# EAGLE design moduloComunicacao3 (EAGLE 9.5.2)
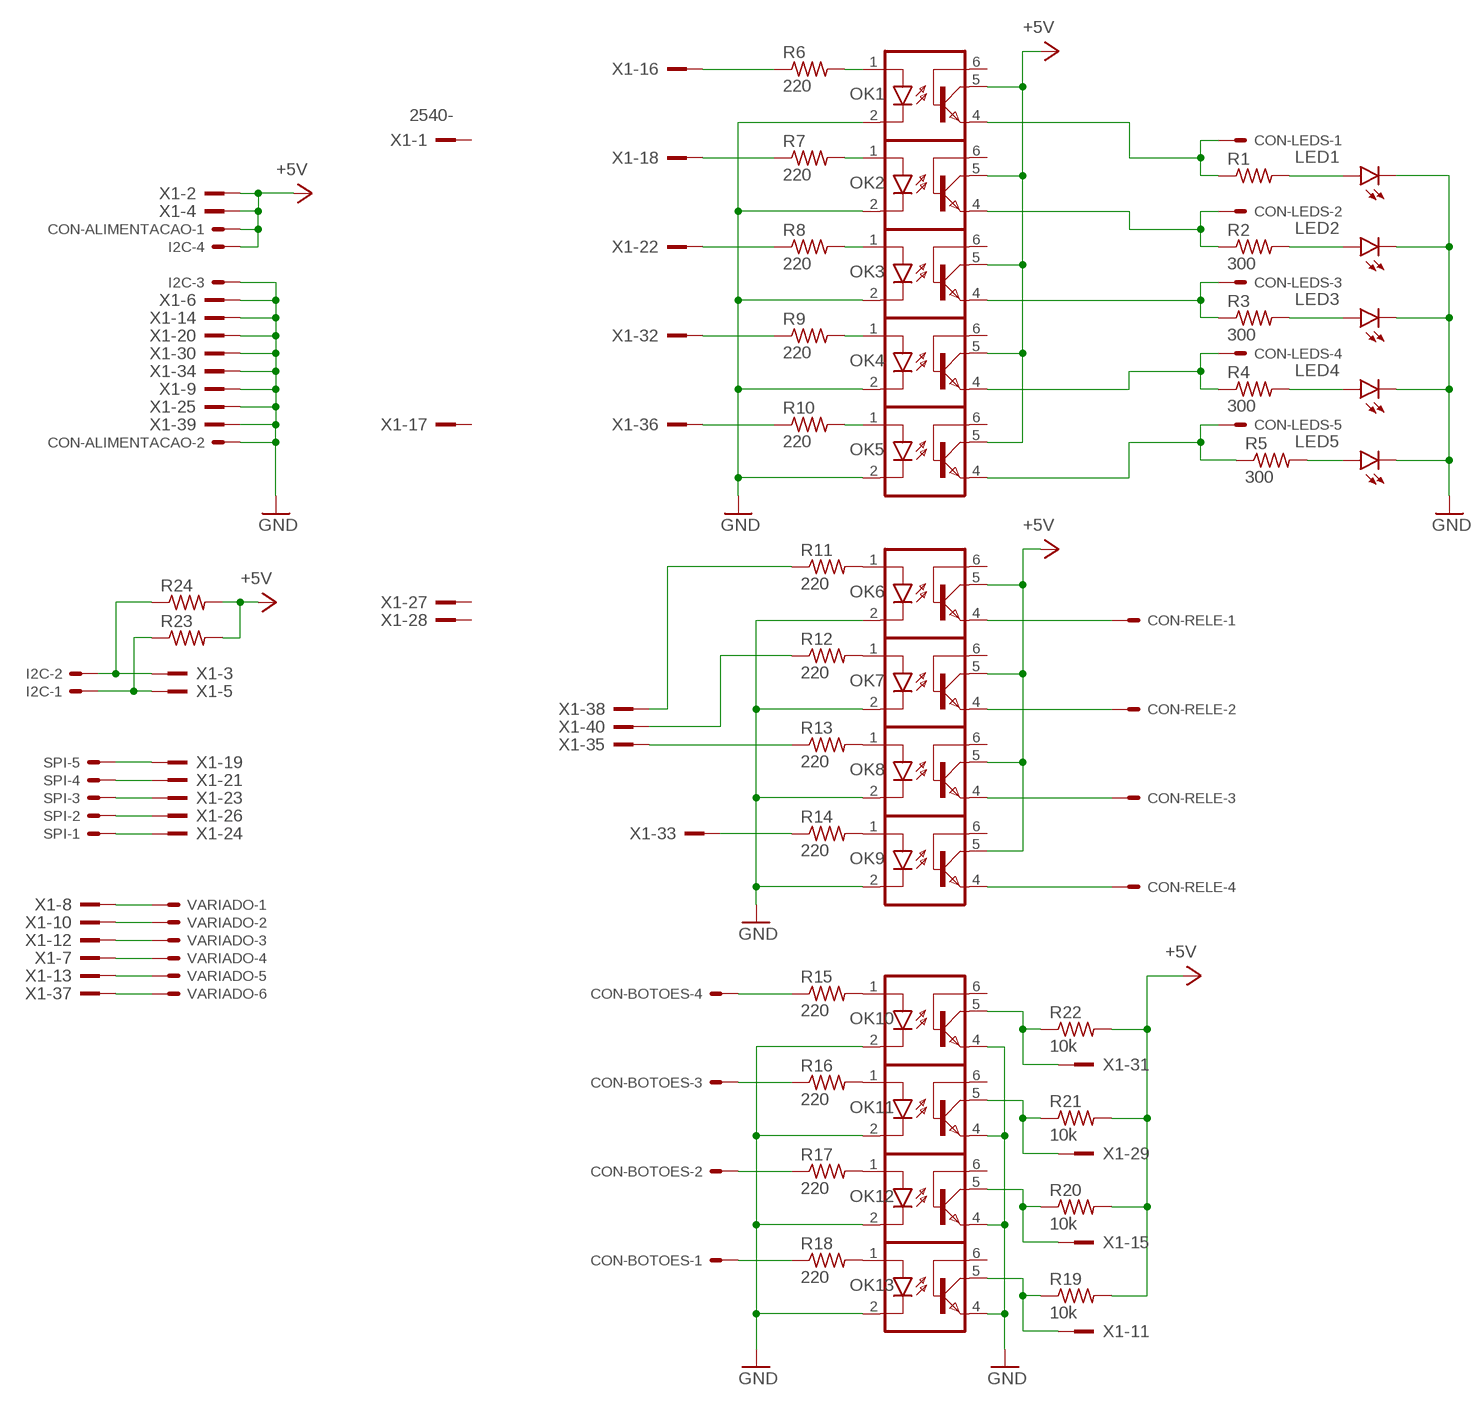
[diagram p0: schematic, sheet 1]

## Parts
CON-ALIMENTACAO  22-23-2021  [22-23-2021]
CON-BOTOES  22-23-2041  [22-23-2041]
CON-LEDS  22-23-2051  [22-23-2051]
CON-RELE  22-23-2041  [22-23-2041]
I2C  22-23-2041  [22-23-2041]
LED1  LED5MM  [LED5MM]
LED2  LED5MM  [LED5MM]
LED3  LED5MM  [LED5MM]
LED4  LED5MM  [LED5MM]
LED5  LED5MM  [LED5MM]
OK1  4N25M  [DIL06]
OK2  4N25M  [DIL06]
OK3  4N25M  [DIL06]
OK4  4N25M  [DIL06]
OK5  4N25M  [DIL06]
OK6  4N25M  [DIL06]
OK7  4N25M  [DIL06]
OK8  4N25M  [DIL06]
OK9  4N25M  [DIL06]
OK10  4N25M  [DIL06]
OK11  4N25M  [DIL06]
OK12  4N25M  [DIL06]
OK13  4N25M  [DIL06]
R1  R-US_0207/12  [0207/12]
R2  300  R-US_0207/12  [0207/12]
R3  300  R-US_0207/12  [0207/12]
R4  300  R-US_0207/12  [0207/12]
R5  300  R-US_0207/12  [0207/12]
R6  220  R-US_0204/7  [0204/7]
R7  220  R-US_0204/7  [0204/7]
R8  220  R-US_0204/7  [0204/7]
R9  220  R-US_0204/7  [0204/7]
R10  220  R-US_0204/7  [0204/7]
R11  220  R-US_0204/7  [0204/7]
R12  220  R-US_0204/7  [0204/7]
R13  220  R-US_0204/7  [0204/7]
R14  220  R-US_0204/7  [0204/7]
R15  220  R-US_0207/10  [0207/10]
R16  220  R-US_0207/10  [0207/10]
R17  220  R-US_0207/10  [0207/10]
R18  220  R-US_0207/10  [0207/10]
R19  10k  R-US_0204/7  [0204/7]
R20  10k  R-US_0204/7  [0204/7]
R21  10k  R-US_0204/7  [0204/7]
R22  10k  R-US_0204/7  [0204/7]
R23  R-US_0204/5  [0204/5]
R24  R-US_0204/5  [0204/5]
SPI  22-23-2051  [22-23-2051]
VARIADO  22-23-2061  [22-23-2061]
X1  2540-  [PAK100/2500-40]

## Nets
+5V: CON-ALIMENTACAO.1 I2C.4 OK1.5(COL) OK2.5(COL) OK3.5(COL) OK4.5(COL) OK5.5(COL) OK6.5(COL) OK7.5(COL) OK8.5(COL) OK9.5(COL) R19.2 R20.2 R21.2 R22.2 R23.2 R24.2 X1.2 X1.4
GND: CON-ALIMENTACAO.2 I2C.3 LED1.K(C) LED2.K(C) LED3.K(C) LED4.K(C) LED5.K(C) OK1.2(C) OK2.2(C) OK3.2(C) OK4.2(C) OK5.2(C) OK6.2(C) OK7.2(C) OK8.2(C) OK9.2(C) OK10.2(C) OK10.4(EMI) OK11.2(C) OK11.4(EMI) OK12.2(C) OK12.4(EMI) OK13.2(C) OK13.4(EMI) X1.6 X1.9 X1.14 X1.20 X1.25 X1.30 X1.34 X1.39
N$1: LED1.A R1.2
N$2: LED2.A R2.2
N$3: LED3.A R3.2
N$4: LED4.A R4.2
N$5: LED5.A R5.2
N$6: CON-LEDS.1 OK1.4(EMI) R1.1
N$7: CON-LEDS.2 OK2.4(EMI) R2.1
N$8: CON-LEDS.3 OK3.4(EMI) R3.1
N$9: CON-LEDS.4 OK4.4(EMI) R4.1
N$10: CON-LEDS.5 OK5.4(EMI) R5.1
N$11: CON-RELE.1 OK6.4(EMI)
N$12: CON-RELE.2 OK7.4(EMI)
N$13: OK1.1(A) R6.2
N$14: OK2.1(A) R7.2
N$15: OK3.1(A) R8.2
N$16: OK4.1(A) R9.2
N$17: OK5.1(A) R10.2
N$18: CON-RELE.3 OK8.4(EMI)
N$19: CON-RELE.4 OK9.4(EMI)
N$20: OK6.1(A) R11.2
N$21: OK7.1(A) R12.2
N$22: OK8.1(A) R13.2
N$23: OK9.1(A) R14.2
N$24: OK10.1(A) R15.2
N$25: OK11.1(A) R16.2
N$26: OK12.1(A) R17.2
N$27: OK13.1(A) R18.2
N$28: CON-BOTOES.4 R15.1
N$29: CON-BOTOES.2 R17.1
N$30: CON-BOTOES.3 R16.1
N$31: CON-BOTOES.1 R18.1
N$32: OK13.5(COL) R19.1 X1.11
N$33: R13.1 X1.35
N$34: OK12.5(COL) R20.1 X1.15
N$35: R12.1 X1.40
N$36: OK11.5(COL) R21.1 X1.29
N$37: R14.1 X1.33
N$38: OK10.5(COL) R22.1 X1.31
N$39: R11.1 X1.38
N$40: R6.1 X1.16
N$41: R7.1 X1.18
N$42: R8.1 X1.22
N$43: R9.1 X1.32
N$44: R10.1 X1.36
N$45: I2C.2 R24.1 X1.3
N$46: I2C.1 R23.1 X1.5
N$47: SPI.5 X1.19
N$48: SPI.4 X1.21
N$49: SPI.3 X1.23
N$50: SPI.2 X1.26
N$51: SPI.1 X1.24
N$52: VARIADO.3 X1.12
N$53: VARIADO.2 X1.10
N$54: VARIADO.1 X1.8
N$55: VARIADO.4 X1.7
N$56: VARIADO.5 X1.13
N$57: VARIADO.6 X1.37
Unconnected: OK1.6(BAS) OK2.6(BAS) OK3.6(BAS) OK4.6(BAS) OK5.6(BAS) OK6.6(BAS) OK7.6(BAS) OK8.6(BAS) OK9.6(BAS) OK10.6(BAS) OK11.6(BAS) OK12.6(BAS) OK13.6(BAS) X1.1 X1.17 X1.27 X1.28

## Library data of the parts
CON-ALIMENTACAO = con-molex:22-23-2021: .100" (2.54mm) Center Header - 2 Pin; MF: MOLEX; MPN: 22-23-2021; OC_FARNELL: 1462926; OC_NEWARK: 25C3832
CON-BOTOES CON-RELE I2C = con-molex:22-23-2041: .100" (2.54mm) Center Header - 4 Pin; MF: MOLEX; MPN: 22-23-2041; OC_FARNELL: 1462920; OC_NEWARK: 38C0355
CON-LEDS SPI = con-molex:22-23-2051: .100" (2.54mm) Center Header - 5 Pin; MF: MOLEX; MPN: 22-23-2051; OC_FARNELL: 1462952; OC_NEWARK: 38C9178
LED1-LED5 = led:LED: LED OSRAM: - CHIPLED LG R971, LG N971, LY N971, LG Q971, LY Q971, LO R971, LY R971 LH N974, LH R974 LS Q976, LO Q976, LY Q976 LO Q996 - Hyper CHIPLED LW Q18S LB Q993, LB Q99A, LB R99A - SideLED LS A670, LO A670, LY A670, LG A670, LP A670 LB A673, LV A673, LT A673, LW A673 LH A674 LY A675 LS A676, LA A676, LO A676, LY A676, LW A676 LS A679, LY A679, LG A679 - Hyper Micro SIDELED® LS Y876, LA Y876, LO Y876, LY Y876 LT Y87S - SmartLED LW L88C, LW L88S LB L89C, LB L89S, LG L890 LS L89K, LO L89K, LY L89K LS L896, LA L896, LO L896, LY L896 - TOPLED LS T670, LO T670, LY T670, LG T670, LP T670 LSG T670, LSP T670, LSY T670, LOP T670, LYG T670 LG T671, LOG T671, LSG T671 LB T673, LV T673, LT T673, LW T673 LH T674 LS T676, LA T676, LO T676, LY T676, LB T676, LH T676, LSB T676, LW T676 LB T67C, LV T67C, LT T67C, LS T67K, LO T67K, LY T67K, LW E67C LS E67B, LA E67B, LO E67B, LY E67B, LB E67C, LV E67C, LT E67C LW T67C LS T679, LY T679, LG T679 LS T770, LO T770, LY T770, LG T770, LP T770 LB T773, LV T773, LT T773, LW T773 LH T774 LS E675, LA E675, LY E675, LS T675 LS T776, LA T776, LO T776, LY T776, LB T776 LHGB T686 LT T68C, LB T68C - Hyper Mini TOPLED® LB M676 - Mini TOPLED Santana® LG M470 LS M47K, LO M47K, LY M47K Source: http://www.osram.convergy.de LUXEON: - LUMILED® LXK2-PW12-R00, LXK2-PW12-S00, LXK2-PW14-U00, LXK2-PW14-V00 LXK2-PM12-R00, LXK2-PM12-S00, LXK2-PM14-U00 LXK2-PE12-Q00, LXK2-PE12-R00, LXK2-PE12-S00, LXK2-PE14-T00, LXK2-PE14-U00 LXK2-PB12-K00, LXK2-PB12-L00, LXK2-PB12-M00, LXK2-PB14-N00, LXK2-PB14-P00, LXK2-PB14-Q00 LXK2-PR12-L00, LXK2-PR12-M00, LXK2-PR14-Q00, LXK2-PR14-R00 LXK2-PD12-Q00, LXK2-PD12-R00, LXK2-PD12-S00 LXK2-PH12-R00, LXK2-PH12-S00 LXK2-PL12-P00, LXK2-PL12-Q00, LXK2-PL12-R00 Source: www.luxeon.com KINGBRIGHT: KA-3528ASYC Source: www.kingbright.com
OK1-OK13 = optocoupler:4N*?M: General Purpose 6-Pin Phototransistor Optocouplers Source: http://www.fairchildsemi.com/ds/4N/4N35-M.pdf; MPN: 4N25-M; OC_FARNELL: 1021349; OC_NEWARK: 98K9084
R1-R24 = rcl:R-US_: RESISTOR, American symbol; SPICEPREFIX: R
VARIADO = con-molex:22-23-2061: .100" (2.54mm) Center Header - 6 Pin; MF: MOLEX; MPN: 22-23-2061; OC_FARNELL: 1462922; OC_NEWARK: 27C1933
X1 = con-3m:2540-: 3M (TM) Pak 100 4-Wall Header Source: 3M; OC_FARNELL: unknown; OC_NEWARK: unknown

## Board
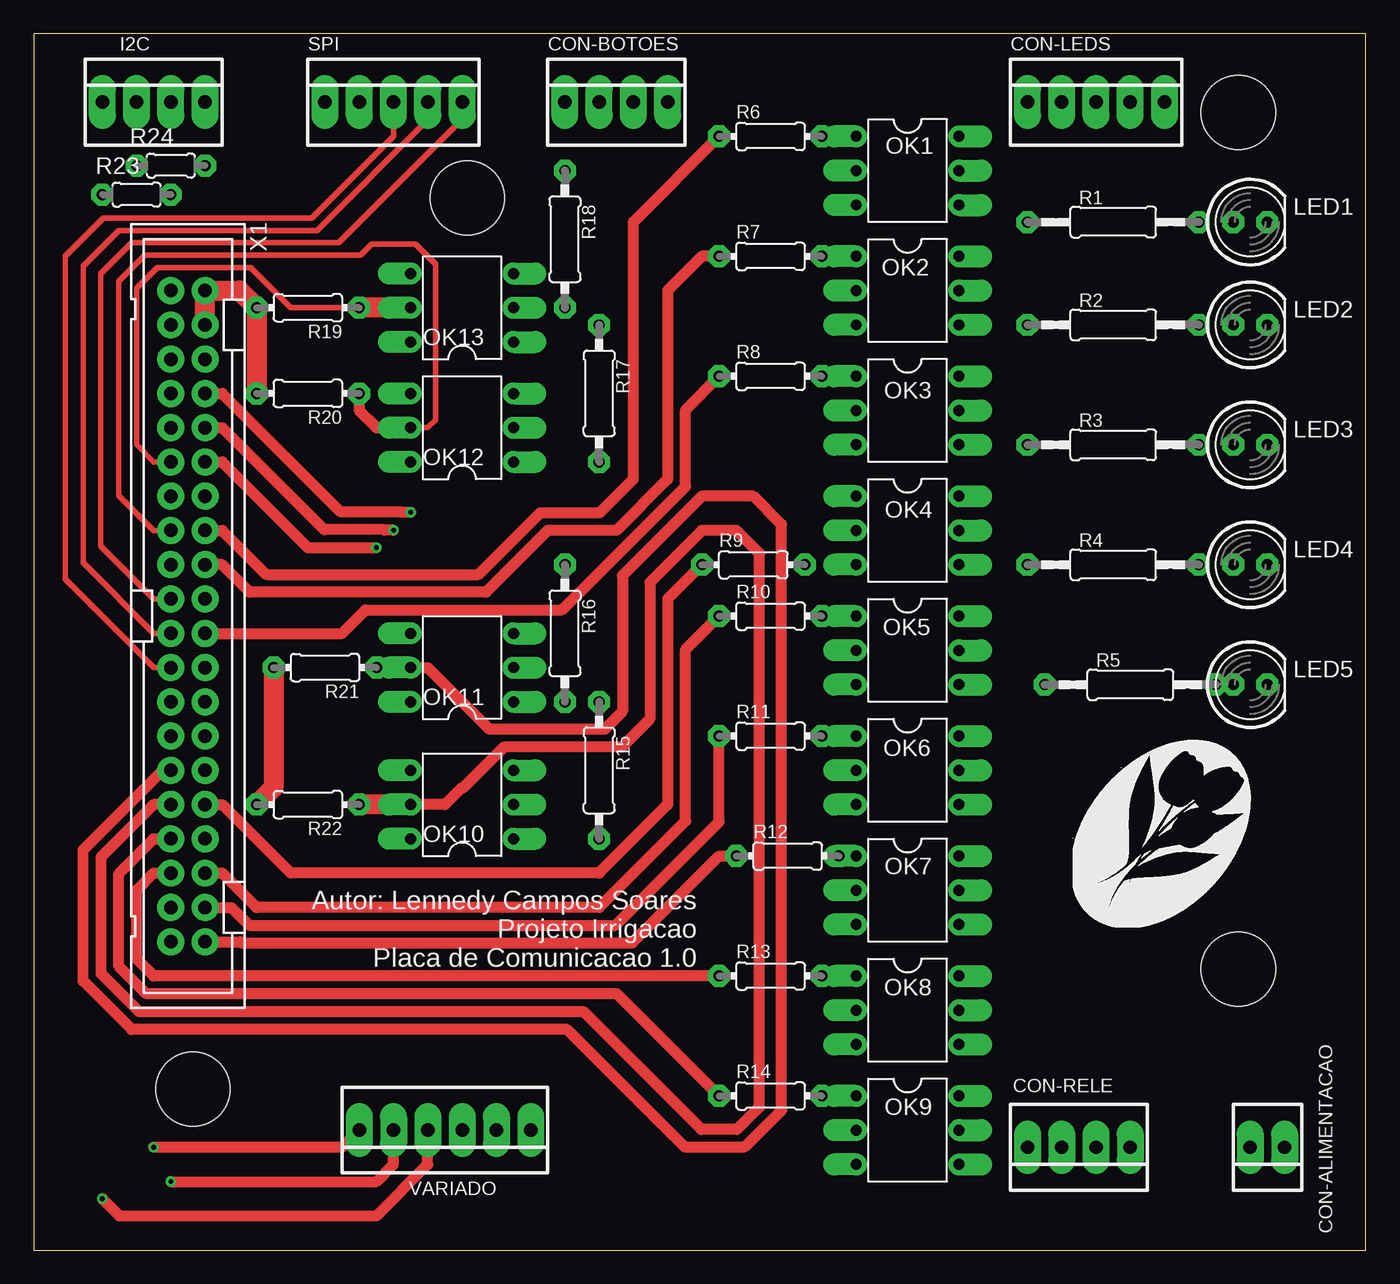
[diagram p1: board, top side]
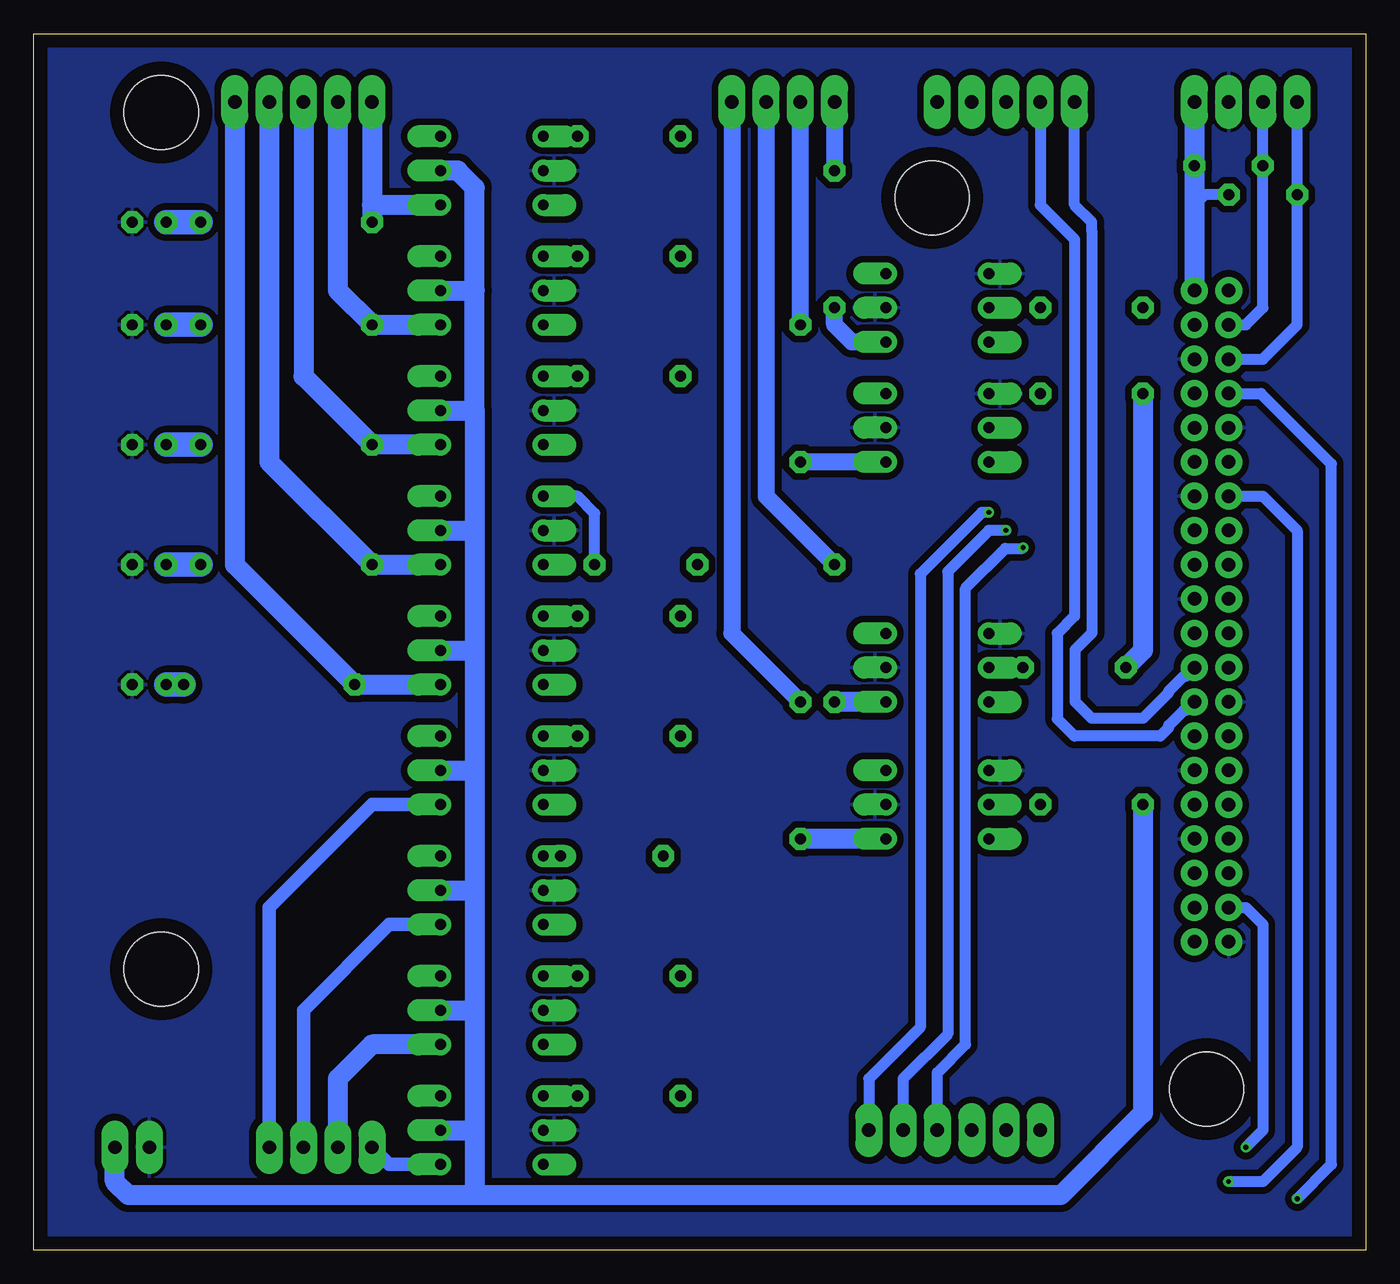
[diagram p2: board, bottom side, seen from below]

Size 98.73 x 90.16 mm. Coordinates in mm from the lower left corner, seen from the top.
Outline: 0,0 98.73,0 98.73,90.16 0,90.16 0,0
Copper layers (1*16): Top 0.035mm / dielectric 1.5mm / Bottom 0.035mm
Design rules "default *": minimum track width 6mil, minimum drill 0.35mm, track to track 20mil, track to pad 20mil, pad to pad 20mil, via to via 20mil, smd to smd 6mil, copper to edge 40mil, drill to drill 6mil, minimum pad ring 10mil, minimum via ring 8mil, stop-mask expansion 4mil, vias tented up to drill 0mil, thermal gap 10mil
Holes 5.5 mm at 11.81,11.94 89.28,20.83 32.13,77.98 89.28,84.33

### Footprints (pad centres in the part's own frame; a part is rotated, then mirrored left to right if it is on the bottom)
22-23-2021 = drill 1 long: 1 -1.27,0; 2 1.27,0
22-23-2041 = drill 1 long: 1 -3.81,0; 2 -1.27,0; 3 1.27,0; 4 3.81,0
22-23-2051 = drill 1 long: 1 -5.08,0; 2 -2.54,0; 3 0,0; 4 2.54,0; 5 5.08,0
LED5MM = drill 0.813 octagon: A -1.27,0; K 1.27,0
DIL06 = drill 0.813 offset: 1 -2.54,-3.81; 2 0,-3.81; 3 2.54,-3.81; 4 2.54,3.81; 5 0,3.81; 6 -2.54,3.81
0207/12 = drill 0.813 octagon: 1 -6.35,0; 2 6.35,0
0204/7 = drill 0.813 octagon: 1 -3.81,0; 2 3.81,0
0207/10 = drill 0.813 octagon: 1 -5.08,0; 2 5.08,0
0204/5 = drill 0.813 octagon: 1 -2.54,0; 2 2.54,0
22-23-2061 = drill 1 long: 1 -6.35,0; 2 -3.81,0; 3 -1.27,0; 4 1.27,0; 5 3.81,0; 6 6.35,0
PAK100/2500-40 = drill 1 pad 1.422: 1 -24.13,-1.27; 2 -24.13,1.27; 3 -21.59,-1.27; 4 -21.59,1.27; 5 -19.05,-1.27; 6 -19.05,1.27; 7 -16.51,-1.27; 8 -16.51,1.27; 9 -13.97,-1.27; 10 -13.97,1.27; 11 -11.43,-1.27; 12 -11.43,1.27; 13 -8.89,-1.27; 14 -8.89,1.27; 15 -6.35,-1.27; 16 -6.35,1.27; 17 -3.81,-1.27; 18 -3.81,1.27; 19 -1.27,-1.27; 20 -1.27,1.27; 21 1.27,-1.27; 22 1.27,1.27; 23 3.81,-1.27; 24 3.81,1.27; 25 6.35,-1.27; 26 6.35,1.27; 27 8.89,-1.27; 28 8.89,1.27; 29 11.43,-1.27; 30 11.43,1.27; 31 13.97,-1.27; 32 13.97,1.27; 33 16.51,-1.27; 34 16.51,1.27; 35 19.05,-1.27; 36 19.05,1.27; 37 21.59,-1.27; 38 21.59,1.27; 39 24.13,-1.27; 40 24.13,1.27

### Placement (x,y rotation side)
CON-ALIMENTACAO  91.44,7.62 180 top
CON-BOTOES  43.18,85.09 0 top
CON-LEDS  78.74,85.09 0 top
CON-RELE  77.47,7.62 180 top
I2C  8.89,85.09 0 top
LED1  90.17,76.2 0 top
LED2  90.17,68.58 0 top
LED3  90.17,59.69 0 top
LED4  90.17,50.8 0 top
LED5  90.17,41.91 0 top
OK1  64.77,80.01 270 top
OK2  64.77,71.12 270 top
OK3  64.77,62.23 270 top
OK4  64.77,53.34 270 top
OK5  64.77,44.45 270 top
OK6  64.77,35.56 270 top
OK7  64.77,26.67 270 top
OK8  64.77,17.78 270 top
OK9  64.77,8.89 270 top
OK10  31.75,33.02 90 top
OK11  31.75,43.18 90 top
OK12  31.75,60.96 90 top
OK13  31.75,69.85 90 top
R1  80.01,76.2 0 top
R2  80.01,68.58 0 top
R3  80.01,59.69 0 top
R4  80.01,50.8 0 top
R5  81.28,41.91 0 top
R6  54.61,82.55 0 top
R7  54.61,73.66 0 top
R8  54.61,64.77 0 top
R9  53.34,50.8 0 top
R10  54.61,46.99 0 top
R11  54.61,38.1 0 top
R12  55.88,29.21 0 top
R13  54.61,20.32 0 top
R14  54.61,11.43 0 top
R15  41.91,35.56 270 top
R16  39.37,45.72 270 top
R17  41.91,63.5 270 top
R18  39.37,74.93 270 top
R19  20.32,69.85 180 top
R20  20.32,63.5 180 top
R21  21.59,43.18 180 top
R22  20.32,33.02 180 top
R23  7.62,78.23 0 top
R24  10.16,80.39 0 top
SPI  26.67,85.09 0 top
VARIADO  30.48,8.89 180 top
X1  11.43,46.99 270 top

### Tracks (layer width: path | path; a pad name or v marks a point on that pad's centre or on a via)
+5V
  Top 1.5: R21.2 17.78,34.29 R22.2 | R20.2 R19.2 15.24,71.12 X1.2 X1.4
  Bottom 0.813: R23.2 11.94,78.23 12.7,77.47 | R24.2 12.7,80.01
  Bottom 1.5: 66.04,4.06 22.61,4.06 16.51,10.16 R22.2 | 66.04,4.06 91.69,4.06 92.71,5.08 CON-ALIMENTACAO.1 | 66.04,62.23 66.04,71.12 | 66.04,62.23 66.04,53.34 | 66.04,53.34 66.04,44.45 | 66.04,44.45 66.04,35.56 | 66.04,35.56 66.04,26.67 | 66.04,26.67 66.04,17.78 | 66.04,17.78 66.04,8.89 | 66.04,8.89 66.04,4.06 | OK9.5 66.04,8.89 | OK8.5 66.04,17.78 | OK7.5 66.04,26.67 | OK6.5 66.04,35.56 | OK5.5 66.04,44.45 | OK4.5 66.04,53.34 | OK3.5 66.04,62.23 | OK2.5 66.04,71.12 | R20.2 16.51,44.45 R21.2 | 66.04,71.12 66.04,78.74 67.31,80.01 OK1.5 | I2C.4 12.7,80.01 12.7,77.47 X1.2
GND
  pour Bottom: 0,90.17 99.06,90.17 99.06,0 0,0
N$1
  Bottom 1.8: R1.2 LED1.A
N$2
  Bottom 1.8: R2.2 LED2.A
N$3
  Bottom 1.8: R3.2 LED3.A
N$4
  Bottom 1.8: R4.2 LED4.A
N$5
  Bottom 1.8: R5.2 LED5.A
N$6
  Bottom 1.5: CON-LEDS.1 73.66,77.47 | 73.66,77.47 R1.1 | OK1.4 73.66,77.47
N$7
  Bottom 1.5: CON-LEDS.2 76.2,71.12 R2.1 OK2.4
N$8
  Bottom 1.5: OK3.4 R3.1 78.74,64.77 CON-LEDS.3
N$9
  Bottom 1.5: CON-LEDS.4 81.28,58.42 R4.1 OK4.4
N$10
  Bottom 1.5: CON-LEDS.5 83.82,50.8 R5.1 OK5.4
N$11
  Bottom 1.016: CON-RELE.1 81.28,25.4 73.66,33.02 OK6.4
N$12
  Bottom 1.016: CON-RELE.2 78.74,17.78 72.39,24.13 OK7.4
N$13
  Bottom 1.016: OK1.1 R6.2
N$14
  Bottom 1.016: OK2.1 R7.2
N$15
  Bottom 1.016: OK3.1 R8.2
N$16
  Bottom 0.813: R9.2 57.15,54.61 58.42,55.88 OK4.1
N$17
  Bottom 1.016: R10.2 OK5.1
N$18
  Bottom 1.5: OK8.4 73.66,15.24 76.2,12.7 CON-RELE.3
N$19
  Bottom 1.016: OK9.4 72.39,6.35 CON-RELE.4
N$20
  Bottom 1.016: R11.2 OK6.1
N$21
  Bottom 1.016: OK7.1 R12.2
N$22
  Bottom 1.016: OK8.1 R13.2
N$23
  Bottom 1.016: OK9.1 R14.2
N$24
  Bottom 1.5: OK10.1 R15.2
N$25
  Bottom 1.5: OK11.1 R16.2
N$26
  Bottom 1.27: OK12.1 R17.2
N$27
  Bottom 1.27: OK13.1 38.1,67.31 39.37,68.58 R18.2
N$28
  Bottom 1.27: CON-BOTOES.4 46.99,45.72 R15.1
N$29
  Bottom 1.27: R17.1 CON-BOTOES.2
N$30
  Bottom 1.27: CON-BOTOES.3 44.45,55.88 R16.1
N$31
  Bottom 1.27: CON-BOTOES.1 R18.1
N$32
  Top 0.406: R19.1 19.05,69.85 16.07,72.83 9.16,72.83 7.62,71.29 7.62,59.69 8.89,58.42 X1.11
  Top 1.5: OK13.5 R19.1
N$33
  Top 0.813: R13.1 8.89,20.32 7.62,21.59 7.62,26.67 8.89,27.94 X1.35
N$34
  Top 0.406: X1.15 8.89,53.34 6.3,55.93 6.3,71.83 8.21,73.75 24.22,73.75 25.03,74.56 28.31,74.56 29.78,73.08 29.78,61.53 29.21,60.96 OK12.5
  Top 0.813: R20.1 24.13,62.23 25.4,60.96 OK12.5
N$35
  Top 0.813: X1.40 15.31,22.86 15.42,22.76 44.35,22.76 50.8,29.21 R12.1
N$36
  Top 0.813: X1.29 9.56,35.56 3.66,29.66 3.66,19.95 7.25,16.36 39.52,16.36 48.26,7.62 52.67,7.62 55.42,10.38 55.42,53.8 53.34,55.88 49.53,55.88 43.64,49.99 43.64,39.92 42.32,38.61 33.78,38.61 29.21,43.18 OK11.5
  Top 1.5: OK11.5 R21.1
N$37
  Top 0.813: X1.33 8.89,30.48 6.3,27.89 6.3,21.04 8.34,19 33.02,19 43.23,19 R14.1
N$38
  Top 0.813: X1.31 8.89,33.02 4.98,29.11 4.98,20.5 7.8,17.68 40.74,17.68 49.48,8.94 52.12,8.94 53.8,10.62 53.8,51.61 52.07,53.34 49.53,53.34 45.67,49.48 45.67,39.37 43.59,37.29 34.84,37.29 31.85,34.29 31.75,34.29 30.48,33.02 OK10.5
  Top 1.5: OK10.5 R22.1
N$39
  Top 0.813: R11.1 50.8,31.75 43.13,24.08 15.96,24.08 14.64,25.4 X1.38
N$40
  Top 0.813: R6.1 44.45,76.2 44.45,57.15 41.96,54.66 37.55,54.66 32.98,50.09 17.22,50.09 13.97,53.34 X1.16
N$41
  Top 0.813: R7.1 49.53,73.66 46.99,71.12 46.99,57.15 43.18,53.34 38.1,53.34 33.53,48.77 16,48.77 13.97,50.8 X1.18
N$42
  Top 0.813: R8.1 48.31,62.28 48.31,56.6 39.16,47.45 24.59,47.45 22.86,45.72 X1.22
N$43
  Top 0.813: X1.32 13.97,33.02 19.05,27.94 41.91,27.94 46.99,33.02 46.99,48.26 R9.1
N$44
  Top 0.813: R10.1 48.31,44.5 48.31,31.8 41.91,25.4 16.51,25.4 13.97,27.94 X1.36
N$45
  Bottom 0.813: X1.3 8.89,68.58 7.62,69.85 7.62,80.01 R24.1 I2C.2
N$46
  Bottom 0.813: X1.5 7.62,66.04 5.08,68.58 R23.1 5.08,78.74 I2C.1
N$47
  Top 0.406: SPI.5 31.75,83.82 22.59,74.66 7.26,74.66 4.98,72.38 4.98,52.17 8.89,48.26 X1.19
N$48
  Top 0.406: SPI.4 29.21,83.8 20.99,75.57 6.3,75.57 3.66,72.93 3.66,50.95 8.89,45.72 X1.21
N$49
  Top 0.406: SPI.3 26.67,82.55 20.61,76.49 5.17,76.49 2.34,73.66 2.34,49.73 8.89,43.18 X1.23
N$50
  Bottom 0.813: SPI.2 24.13,77.47 21.59,74.93 21.59,46.99 22.86,45.72 22.86,39.37 21.59,38.1 15.24,38.1 14.61,38.73 14.61,38.89 13.49,40.01 13.33,40.01 X1.26
N$51
  Bottom 0.813: SPI.1 21.59,77.47 20.32,76.2 20.32,75.53 20.27,75.48 20.27,45.77 21.54,44.5 21.54,40.64 20.32,39.42 16.51,39.42 14.61,41.32 14.61,41.43 13.49,42.55 13.33,42.55 X1.24
N$52  (via drill 0.35)
  Top 0.813: X1.12 13.97,58.42 20.32,52.07 v25.4,52.07
  Bottom 0.813: v25.4,52.07 25.45,52.02 26.72,52.02 29.67,49.07 29.67,15.24 31.75,13.16 VARIADO.3
N$53  (via drill 0.35)
  Top 0.813: X1.10 13.97,60.96 21.54,53.39 25.95,53.39 25.98,53.36 v26.67,53.36
  Bottom 0.813: v26.67,53.36 26.69,53.34 27.94,53.34 30.99,50.29 30.99,16 34.29,12.7 VARIADO.2
N$54  (via drill 0.35)
  Top 0.813: X1.8 13.97,63.5 22.76,54.71 27.22,54.71 27.24,54.68 v27.94,54.68
  Bottom 0.813: v27.94,54.68 28.46,54.68 33.02,50.13 33.02,16.51 36.83,12.7 VARIADO.1
N$55  (via drill 0.35)
  Top 0.813: v5.08,3.81 6.35,2.54 25.4,2.54 29.21,6.35 VARIADO.4
  Bottom 0.813: X1.7 7.77,63.5 2.54,58.27 2.54,6.35 v5.08,3.81
N$56  (via drill 0.35)
  Top 0.813: v10.16,5.08 25.4,5.08 26.67,6.35 VARIADO.5
  Bottom 0.813: X1.13 7.62,55.88 5.08,53.34 5.08,7.62 7.62,5.08 v10.16,5.08
N$57  (via drill 0.35)
  Top 0.813: v8.89,7.62 22.86,7.62 VARIADO.6
  Bottom 0.813: X1.37 8.89,25.4 7.62,24.13 7.62,8.89 v8.89,7.62

### Text on the board
tNames: Autor: Lennedy Campos Soares / Projeto Irrigacao / Placa de Comunicacao 1.0